# Altium schematic sheet S2C.SchDoc
size A4; SheetNumber: 11
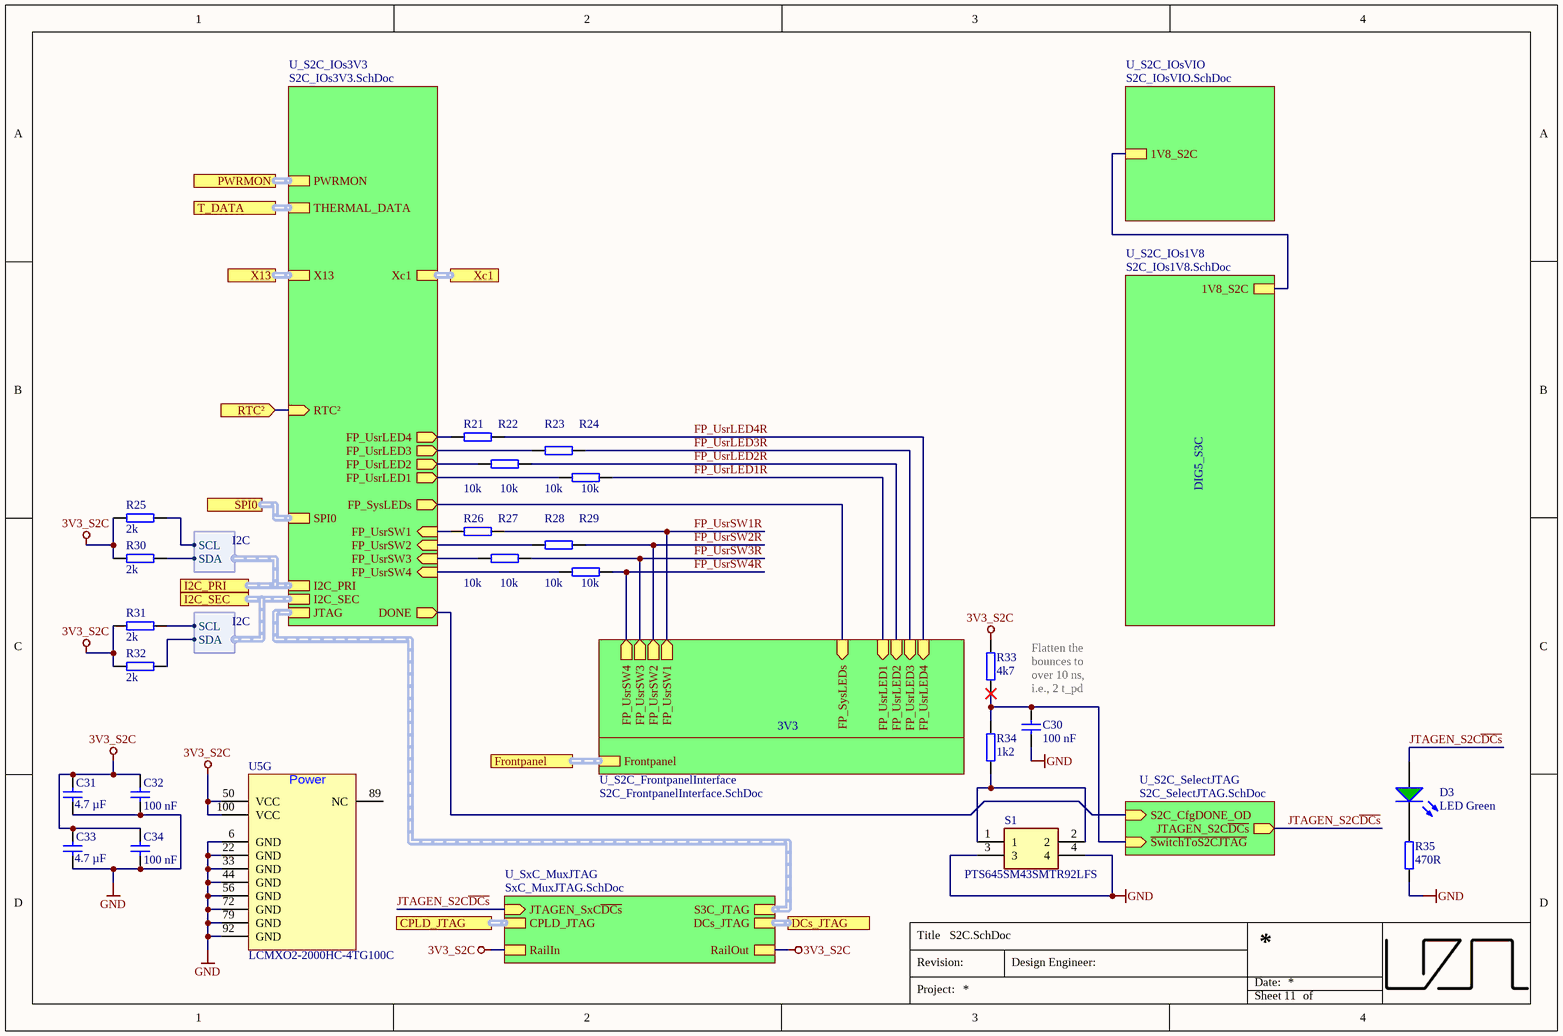
[diagram p0: S2C.SchDoc]

## Parts
C30  100 nF  [C_0603_TE]
C31  4.7 µF  [C_0603_TE]
C32  100 nF  [C_0603_TE]
C33  4.7 µF  [C_0603_TE]
C34  100 nF  [C_0603_TE]
D3  LED Green  [WL-SMCW_0603]
R21  10k  [R_0603_TE]
R22  10k  [R_0603_TE]
R23  10k  [R_0603_TE]
R24  10k  [R_0603_TE]
R25  2k  [R_0603_TE]
R26  10k  [R_0603_TE]
R27  10k  [R_0603_TE]
R28  10k  [R_0603_TE]
R29  10k  [R_0603_TE]
R30  2k  [R_0603_TE]
R31  2k  [R_0603_TE]
R32  2k  [R_0603_TE]
R33  4k7  [R_0603_TE]
R34  1k2  [R_0603_TE]
R35  470R  [R_0603_TE]
S1  PTS645SM43SMTR92LFS  [PTS645_SMT]
U5  LCMXO2-2000HC-4TG100C  [QFP50P1600X1600X160-100N]  (part G of 7)

## Sub-sheets
U_S2C_FrontpanelInterface = S2C_FrontpanelInterface.SchDoc: FP_UsrSW4 (out), FP_UsrSW3 (out), FP_UsrSW2 (out), FP_UsrSW1 (out), FP_UsrLED4 (in), FP_UsrLED3 (in), FP_UsrLED2 (in), FP_UsrLED1 (in), Frontpanel (harness Frontpanel), FP_SysLEDs (in)
U_S2C_IOs1V8 = S2C_IOs1V8.SchDoc: 1V8_S2C
U_S2C_IOs3V3 = S2C_IOs3V3.SchDoc: JTAG (harness JTAG_S3C), I2C_PRI (harness I2C), THERMAL_DATA (harness T_DATA), PWRMON (harness S2C_PWRMON), FP_UsrSW3 (in), FP_UsrSW2 (in), FP_UsrSW1 (in), FP_UsrLED1 (out), FP_SysLEDs (out), I2C_SEC (harness I2C), FP_UsrSW4 (in), FP_UsrLED2 (out), FP_UsrLED3 (out), FP_UsrLED4 (out), DONE (out), SPI0 (harness SPI0), X13 (harness X13), Xc1 (harness Xc1), RTC² (in)
U_S2C_IOsVIO = S2C_IOsVIO.SchDoc: 1V8_S2C
U_S2C_SelectJTAG = S2C_SelectJTAG.SchDoc: JTAGEN_S2C~{DCs} (out), ~{SwitchToS2CJTAG} (in), S2C_CfgDONE_OD (in)
U_SxC_MuxJTAG = SxC_MuxJTAG.SchDoc: CPLD_JTAG (harness JTAG), JTAGEN_SxC~{DCs} (in), S3C_JTAG (harness JTAG_S3C), DCs_JTAG (harness JTAG), RailIn, RailOut  | SubSheet_SheetNumber: 17

## Ports
CPLD_JTAG (harness JTAG), DCs_JTAG (harness JTAG), Frontpanel (harness Frontpanel), I2C_PRI (harness I2C), I2C_SEC (harness I2C), PWRMON (harness S2C_PWRMON), RTC² (in), SPI0 (harness SPI0), T_DATA (harness T_DATA), X13 (harness X13), Xc1 (harness Xc1)

## Harnesses
I2C: SCL, SDA

## Nets
3V3_S2C: C31.1 C32.2 C33.1 C34.2 R25.2 R30.2 R31.2 R32.2 R33.2 U5.50(VCC) U5.100(VCC) ; sheet U_SxC_MuxJTAG/RailIn, sheet U_SxC_MuxJTAG/RailOut
GND: C30.1 C31.2 C32.1 C33.2 C34.1 R35.2 S1.3 S1.4 U5.6(GND) U5.22(GND) U5.33(GND) U5.44(GND) U5.56(GND) U5.72(GND) U5.79(GND) U5.92(GND)
FP_UsrLED1R: R24.2 ; sheet U_S2C_FrontpanelInterface/FP_UsrLED1
FP_UsrLED2R: R22.2 ; sheet U_S2C_FrontpanelInterface/FP_UsrLED2
FP_UsrLED3R: R23.2 ; sheet U_S2C_FrontpanelInterface/FP_UsrLED3
FP_UsrLED4R: R21.2 ; sheet U_S2C_FrontpanelInterface/FP_UsrLED4
FP_UsrSW1R: R26.2 ; sheet U_S2C_FrontpanelInterface/FP_UsrSW1
FP_UsrSW2R: R28.2 ; sheet U_S2C_FrontpanelInterface/FP_UsrSW2
FP_UsrSW3R: R27.2 ; sheet U_S2C_FrontpanelInterface/FP_UsrSW3
FP_UsrSW4R: R29.2 ; sheet U_S2C_FrontpanelInterface/FP_UsrSW4
JTAGEN_S2C~{DCs}: D3.2(A) ; sheet U_SxC_MuxJTAG/JTAGEN_SxC~{DCs}, sheet U_S2C_SelectJTAG/JTAGEN_S2C~{DCs}
RTC²: port RTC², sheet U_S2C_IOs3V3/RTC²
NetC30_2: C30.2 R33.1 R34.2 ; sheet U_S2C_SelectJTAG/~{SwitchToS2CJTAG}
NetD3_1: D3.1(K) R35.1
NetR21_1: R21.1 ; sheet U_S2C_IOs3V3/FP_UsrLED4
NetR22_1: R22.1 ; sheet U_S2C_IOs3V3/FP_UsrLED2
NetR23_1: R23.1 ; sheet U_S2C_IOs3V3/FP_UsrLED3
NetR24_1: R24.1 ; sheet U_S2C_IOs3V3/FP_UsrLED1
NetR25_1: R25.1 ; port I2C_PRI.SCL
NetR26_1: R26.1 ; sheet U_S2C_IOs3V3/FP_UsrSW1
NetR27_1: R27.1 ; sheet U_S2C_IOs3V3/FP_UsrSW3
NetR28_1: R28.1 ; sheet U_S2C_IOs3V3/FP_UsrSW2
NetR29_1: R29.1 ; sheet U_S2C_IOs3V3/FP_UsrSW4
NetR30_1: R30.1 ; port I2C_PRI.SDA
NetR31_1: R31.1 ; port I2C_SEC.SCL
NetR32_1: R32.1 ; port I2C_SEC.SDA
NetR34_1: R34.1 S1.1 S1.2
(unnamed): sheet U_S2C_IOs3V3/FP_SysLEDs, sheet U_S2C_FrontpanelInterface/FP_SysLEDs
(unnamed): sheet U_S2C_IOs3V3/DONE, sheet U_S2C_SelectJTAG/S2C_CfgDONE_OD
(unnamed): sheet U_S2C_IOs1V8/1V8_S2C, sheet U_S2C_IOsVIO/1V8_S2C

Not connected (* = marked no-connect by the designer): U5 89(NC)

## Buses and harness runs
harness port CPLD_JTAG = sheet U_SxC_MuxJTAG/CPLD_JTAG
harness port DCs_JTAG = sheet U_SxC_MuxJTAG/DCs_JTAG
harness port Frontpanel = sheet U_S2C_FrontpanelInterface/Frontpanel
harness port I2C_PRI = sheet U_S2C_IOs3V3/I2C_PRI
harness port I2C_SEC = sheet U_S2C_IOs3V3/I2C_SEC
harness port PWRMON = sheet U_S2C_IOs3V3/PWRMON
harness port SPI0 = sheet U_S2C_IOs3V3/SPI0
harness port T_DATA = sheet U_S2C_IOs3V3/THERMAL_DATA
harness port X13 = sheet U_S2C_IOs3V3/X13
harness port Xc1 = sheet U_S2C_IOs3V3/Xc1
harness sheet U_S2C_IOs3V3/JTAG = sheet U_SxC_MuxJTAG/S3C_JTAG

## Notes on the sheet
- DIG5_S3C
- Flatten the bounces to over 10 ns, i.e., 2 t_pd
- 3V3
- Title
- Revision:
- Design Engineer:
- Date:
- Project:
- Sheet
- of
- (in symbol LCMXO2-2000HC-4TG100C, part G) Power

## Library data of the parts
C30 = UZgen_C_0603_100nF_50V_X7R: Generic capacitor; Manufacturer: UZgen; Voltage: 50V; Tolerance: 10 %; Created from: AGeiger; Manufacturer Part Number: UZgen_C_0603_100nF_50V_X7R; PartID: 1; Created On: 02/07/2024 14:42:23; Value: 100 nF; Device Package: 0603; Technology: X7R; Mounting Type: SMD; Last Updated: 08/08/2024 15:01:15
C31 C33 = UZgen_C_0603_4.7uF_16V_X5R: Generic capacitor; Manufacturer: UZgen; Voltage: 16V; Tolerance: 10 %; Created from: MGeier; Manufacturer Part Number: UZgen_C_0603_4.7uF_16V_X5R; PartID: 5809; Created On: 20/03/2025 14:43:45; Value: 4.7 µF; Device Package: 0603; Technology: X5R; Mounting Type: SMD; Last Updated: 20/03/2025 14:43:45
C32 C34 = UZgen_C_0603_100nF_50V_X7R: Generic capacitor; Manufacturer: UZgen; Tolerance: 10 %; Voltage: 50 V; Created from: AGeiger; Value: 100 nF; Technology: X7R; Manufacturer Part Number: UZgen_C_0603_100nF_50V_X7R; PartID: 1; Created On: 02/07/2024 14:42:23; Device Package: 0603; Mounting Type: SMD; Last Updated: 02/08/2024 14:45:57
D3 = UZgen_LED_0603_Green: Standard LEDs - SMD 0603 green; Manufacturer: UZgen; Created from: UZgenTool; Manufacturer Part Number: UZgen_LED_0603_Green; PartID: 21; Created On: 09/09/2024 10:45:01; ComponentLink1Description: N/A; ComponentLink1URL: N/A; Component Type: LED Diode; Device Package: 0603; Last Updated: 09/09/2024 10:45:01; Mounting Type: SMD; Supplier 1: LCSC; Supplier Part Number 1: =LCSC Part Number; Type: Standard; Value: LED Green; Live Cycle Status: 1; Stock number: not stored; Color: green
R21-R24 R26-R29 = UZgen_R_0603_10k: Generic resistor; Manufacturer: UZgen; Tolerance: 1 %; Created from: AGeiger; Value: 10k; Manufacturer Part Number: UZgen_R_0603_10k; PartID: 1; Created On: 02/07/2024 14:34:53; Device Package: 0603; Mounting Type: SMD; Last Updated: 02/07/2024 14:37:16
R25 R30-R32 = UZgen_R_0603_2k: Generic resistor; Manufacturer: UZgen; Tolerance: 1 %; Created from: UZgenTool; Value: 2k; Manufacturer Part Number: UZgen_R_0603_2k; PartID: 228; Created On: 02/07/2024 17:29:49; Device Package: 0603; Mounting Type: SMD; Last Updated: 02/07/2024 17:29:49
R33 = UZgen_R_0603_4k7: Generic resistor; Manufacturer: UZgen; Tolerance: 1 %; Created from: UZgenTool; Manufacturer Part Number: UZgen_R_0603_4k7; PartID: 237; Created On: 02/07/2024 17:29:50; Value: 4k7; Device Package: 0603; Mounting Type: SMD; Last Updated: 02/07/2024 17:29:50
R34 = UZgen_R_0603_1k2: Generic resistor; Manufacturer: UZgen; Tolerance: 1 %; Created from: UZgenTool; Manufacturer Part Number: UZgen_R_0603_1k2; PartID: 223; Created On: 02/07/2024 17:29:49; Value: 1k2; Device Package: 0603; Mounting Type: SMD; Last Updated: 02/07/2024 17:29:49
R35 = UZgen_R_0603_470R: Generic resistor; Manufacturer: UZgen; Tolerance: 1 %; Created from: UZgenTool; Manufacturer Part Number: UZgen_R_0603_470R; PartID: 213; Created On: 02/07/2024 17:29:49; Value: 470R; Device Package: 0603; Mounting Type: SMD; Last Updated: 02/07/2024 17:29:49
S1 = PTS645SM43SMTR92LFS: 50mA SPST 160gf 12V SMD-4P,6x6mm Tactile Switches ROHS; Manufacturer_Name: C & K COMPONENTS; Manufacturer: C&K COMPONENTS; Value: Push Button; Created from: AGeiger; Datasheet Link: https://www.ckswitches.com/media/1471/pts645.pdf; Manufacturer_Part_Number: PTS645SM43SMTR92LFS; Mouser Part Number: 611-PTS645SM43SMTR92; Mouser Price/Stock: https://www.mouser.co.uk/ProductDetail/CK/PTS645SM43SMTR92LFS?qs=FESYatJ8odKPktxv6ncfWg%3D%3D; Arrow Part Number: PTS645SM43SMTR92LFS; Arrow Price/Stock: https://www.arrow.com/en/products/pts645sm43smtr92lfs/ck; Manufacturer Part Number: PTS645SM43SMTR92LFS; PartID: 24; Created On: 31/05/2023 15:31:02; ComponentLink1Description: Datasheet; ComponentLink1URL: https://datasheet.lcsc.com/lcsc/1810121628_C-K-PTS645SM43SMTR92LFS_C221880.pdf; Component Type: Tactile Switch; Device Package: SMD; Last Updated: 31/05/2023 15:31:02; Mounting Type: SMD; Operating Temperature: -20 to +60 °C; Supplier 1: Mouser; Supplier Part Number 1: 611-PTS645SM43SMTR92; Supplier 2: LCSC; Supplier Part Number 2: C221880; Type: Tactile Switch; Live Cycle Status: 1; LCSC Part Number: C221880
U5 = LCMXO2-2000HC-4TG100C: TQFP-100(14x14) Programmable Logic Device (CPLDs/FPGAs) ROHS; Manufacturer: Lattice; Created from: FRosner; Manufacturer Part Number: LCMXO2-2000HC-4TG100C; PartID: 37; Created On: 03/07/2024 17:33:36; ComponentLink1Description: Datasheet; ComponentLink1URL: https://wmsc.lcsc.com/wmsc/upload/file/pdf/v2/lcsc/2403111456_Lattice-LCMXO2-2000HC-4TG100C_C1521632.pdf; Component Type: CPLD; Device Package: TQFP-100; Last Updated: 23/08/2024 11:42:29; Mounting Type: SMD; Operating Temperature: -0 to +85 °C; Supplier 1: LCSC; Supplier Part Number 1: C1521632; Supplier 2: Mouser; Supplier Part Number 2: 842-XO22000HC4TG100C; Type: CPLD; Live Cycle Status: 1; LCSC Part Number: C1521632; Stock number: not stored